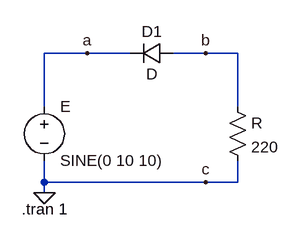
[diagram p0: schematic Draft6.asc]
Draft6.asc, the LTspice schematic file:
Version 4
SHEET 1 880 680
WIRE 144 64 80 64
WIRE 208 64 144 64
WIRE 320 64 272 64
WIRE 368 64 320 64
WIRE 80 144 80 64
WIRE 368 144 368 64
WIRE 80 256 80 224
WIRE 320 256 80 256
WIRE 368 256 368 224
WIRE 368 256 320 256
WIRE 80 272 80 256
FLAG 80 272 0
FLAG 144 64 a
FLAG 320 64 b
FLAG 320 256 c
SYMBOL voltage 80 128 R0
WINDOW 123 0 0 Left 0
WINDOW 39 0 0 Left 0
SYMATTR InstName E
SYMATTR Value SINE(0 10 10)
SYMBOL diode 272 48 R90
WINDOW 0 0 32 VBottom 2
WINDOW 3 32 32 VTop 2
SYMATTR InstName D1
SYMBOL res 352 128 R0
SYMATTR InstName R
SYMATTR Value 220
SYMATTR SpiceLine tol=1 pwr=0.1
TEXT 46 296 Left 2 !.tran 1

The netlist it stands for:
* Draft6.asc
V§E a 0 SINE(0 10 10)
D1 b a D
R b 0 220 tol=1 pwr=0.1
.model D D
.lib standard.dio
.tran 1
.backanno
.end

* Results of the author's LTspice run, read from the files saved beside the schematic
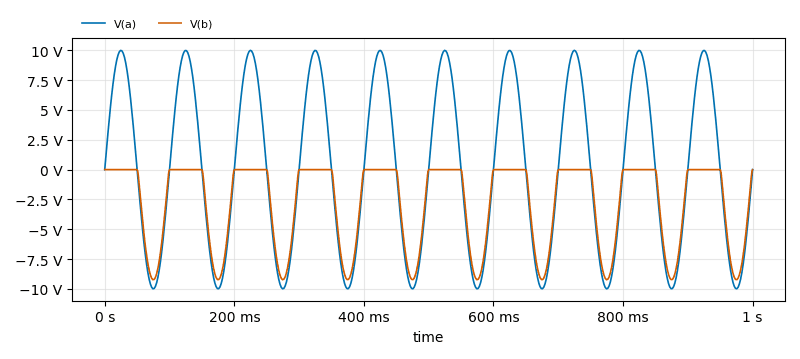
[diagram p1: Transient Analysis of Draft6.asc, plotted from the saved traces]
* Transient Analysis, 1 run:
*   V(a): min -9.995 V, max 9.998 V, average -34.24 µV, rms 7.07 V, last 0 V
*   V(b): min -9.234 V, max 0 V, average -2.822 V, rms 4.527 V, last 0 V